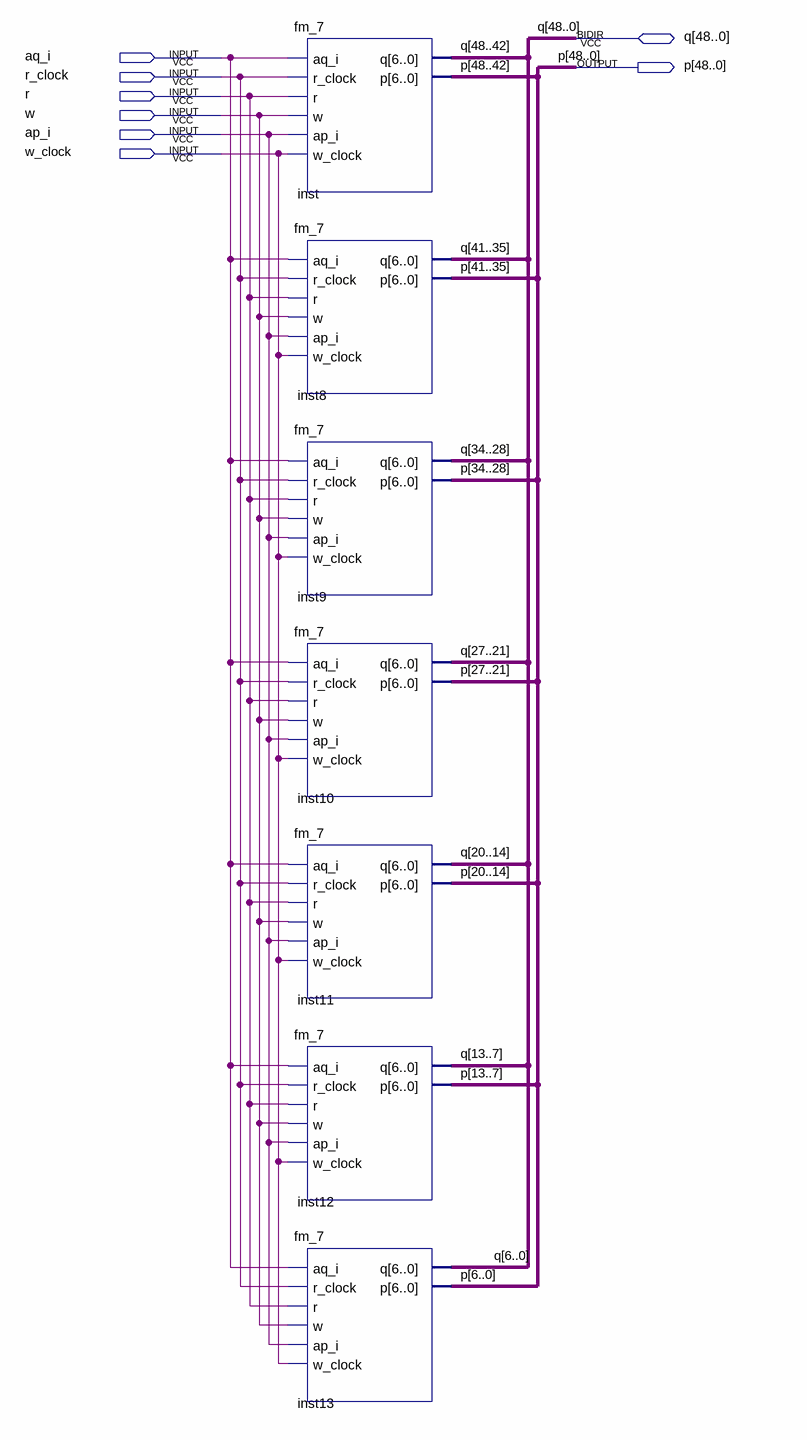
[diagram p0: schematic sheet]
// Quartus schematic fm_48.bdf as structural Verilog: 7 symbols, 8 pins
module fm_48 (
  input  aq_i,
  input  r_clock,
  input  r,
  input  w,
  input  ap_i,
  input  w_clock,
  inout  [48:0] q,
  output [48:0] p
);

  fm_7 inst (.aq_i(aq_i), .r_clock(r_clock), .r(r), .w(w), .ap_i(ap_i), .w_clock(w_clock), .p(p[48:42]), .q(q[48:42]));
  fm_7 inst8 (.aq_i(aq_i), .r_clock(r_clock), .r(r), .w(w), .ap_i(ap_i), .w_clock(w_clock), .p(p[41:35]), .q(q[41:35]));
  fm_7 inst9 (.aq_i(aq_i), .r_clock(r_clock), .r(r), .w(w), .ap_i(ap_i), .w_clock(w_clock), .p(p[34:28]), .q(q[34:28]));
  fm_7 inst10 (
    .aq_i(aq_i), .r_clock(r_clock), .r(r), .w(w), .ap_i(ap_i), .w_clock(w_clock), .p(p[27:21]), .q(q[27:21]));
  fm_7 inst11 (
    .aq_i(aq_i), .r_clock(r_clock), .r(r), .w(w), .ap_i(ap_i), .w_clock(w_clock), .p(p[20:14]), .q(q[20:14]));
  fm_7 inst12 (.aq_i(aq_i), .r_clock(r_clock), .r(r), .w(w), .ap_i(ap_i), .w_clock(w_clock), .p(p[13:7]), .q(q[13:7]));
  fm_7 inst13 (.aq_i(aq_i), .r_clock(r_clock), .r(r), .w(w), .ap_i(ap_i), .w_clock(w_clock), .p(p[6:0]), .q(q[6:0]));
endmodule
